# EAGLE schematic Switch_Mini (EAGLE 9.4.2)
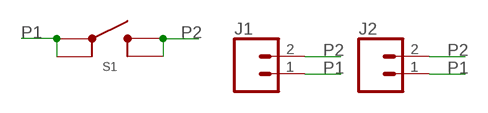
[diagram p0: schematic, sheet 1]

## Parts
J1  CONN_02  [1X02]
J2  CONN_02  [1X02]
S1  BUTTON4.2X3.2  [SWITCH_4.2X3.2]

## Nets
P1: J1.1 J2.1 S1.1 S1.2
P2: J1.2 J2.2 S1.3 S1.4

## Library data of the parts
J1 J2 = bschulz:CONN_02: Genaric 2 terminal header SCREW_2.54 <https://www.digikey.com/product-detail/en/on-shore-technology-inc/OSTVN02A150/ED10561-ND/1588862> 39532_RA <https://www.digikey.com/product-detail/en/molex/0395321002/WM7845-ND/1280696>
S1 = bschulz:BUTTON: Genaric SPST Pushbutton; DIGIKEY: CKN10504CT-ND; MF: C&K; MPN: PTS810 SJG 250 SMTR LFS